# EAGLE design LEDPlate (EAGLE 6.5.0)
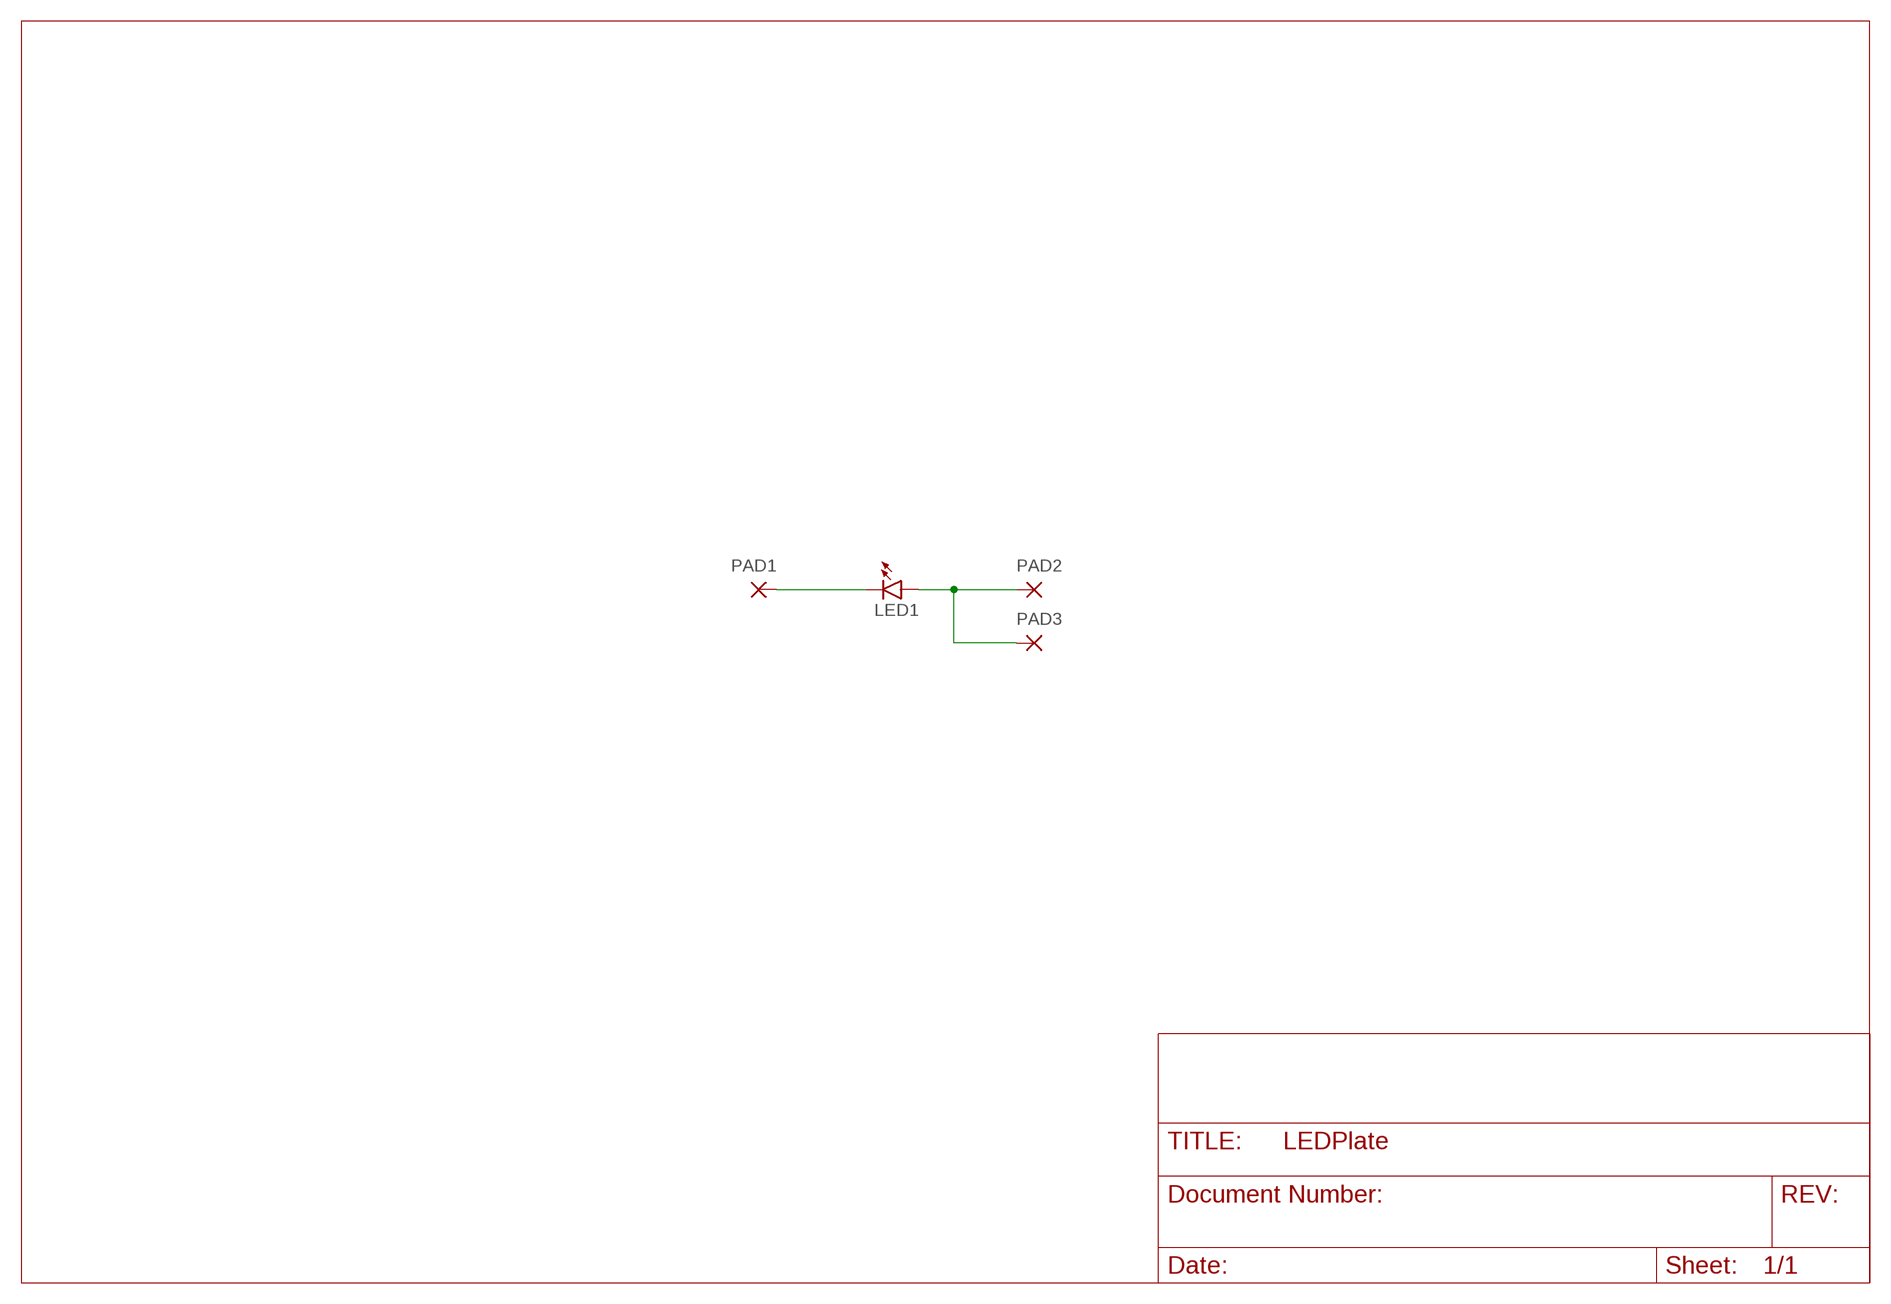
[diagram p0: schematic, sheet 1]

## Parts
LED1  LED2  [P-C8WT803]
PAD1  PAD  [P-SMD1.27X2.54]
PAD2  PAD  [P-SMD1.27X2.54]
PAD3  PAD  [P-SMD1.27X2.54]

## Nets
N$1: LED1.C PAD1.1(P)
N$2: LED1.A PAD2.1(P) PAD3.1(P)

## Library data of the parts
LED1 = dn-electronics:LED: LED 1) PLCC2 2) C8WT803
PAD1-PAD3 = dn-electronics:PAD: PADs

## Board
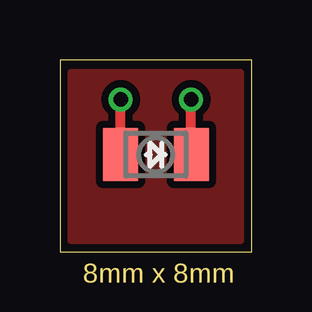
[diagram p1: board, top side]
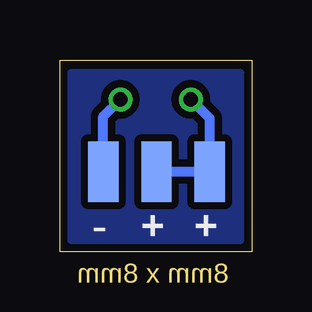
[diagram p2: board, bottom side, seen from below]

Size 8 x 8 mm. Coordinates in mm from the lower left corner, seen from the top.
Outline: 0,0 8,0 8,8 0,8 0,0
Copper layers (1*16): Top 0.018mm / dielectric 1.55mm / Bottom 0.018mm
Design rules "eC_2Layer_PClass6_BaseCopperO18_DNE": minimum track width 0.15mm, minimum drill 0.35mm, track to track 0.15mm, track to pad 0.15mm, pad to pad 0.15mm, via to via 0.15mm, smd to smd 0mil, copper to edge 0.25mm, drill to drill 0.35mm, minimum pad ring 0.2mm, minimum via ring 0.2mm, stop-mask expansion 0mil, vias tented up to drill 0.45mm, thermal gap 0.25mm

### Footprints (pad centres in the part's own frame; a part is rotated, then mirrored left to right if it is on the bottom)
P-C8WT803 = smd 1.45 x 2.2: A -1.475,0; C 1.475,0
P-SMD1.27X2.54 = smd 1.27 x 2.54: 1 0,0

### Placement (x,y rotation side)
LED1  4.01,4.05 0 top
PAD1  6.19,3.33 0 bottom
PAD2  3.97,3.33 0 bottom
PAD3  1.75,3.33 0 bottom

### Tracks (layer width: path | path; a pad name or v marks a point on that pad's centre or on a via)
N$1  (via drill 0.6)
  Top 0.406: 5.4,4.13 LED1.C v5.48,6.35
  Bottom 0.406: PAD1.1 6.19,5.64 v5.48,6.35
N$2  (via drill 0.6)
  Top 0.406: LED1.A v2.54,6.35
  Bottom 0.406: PAD2.1 PAD3.1 1.75,5.56 v2.54,6.35
N$3
  pour Bottom (isolate 0.305): 0.48,7.46 0.48,0.48 7.54,0.48 7.54,7.46
  pour Top (isolate 0.305): 0.48,7.46 0.48,0.48 7.54,0.48 7.54,7.46

### Text on the board
Dimension: 8mm x 8mm
bNames: + | + | -